# EAGLE design pCog105_LogicStart (EAGLE 6.6.0)

## Sheet 1 of 4
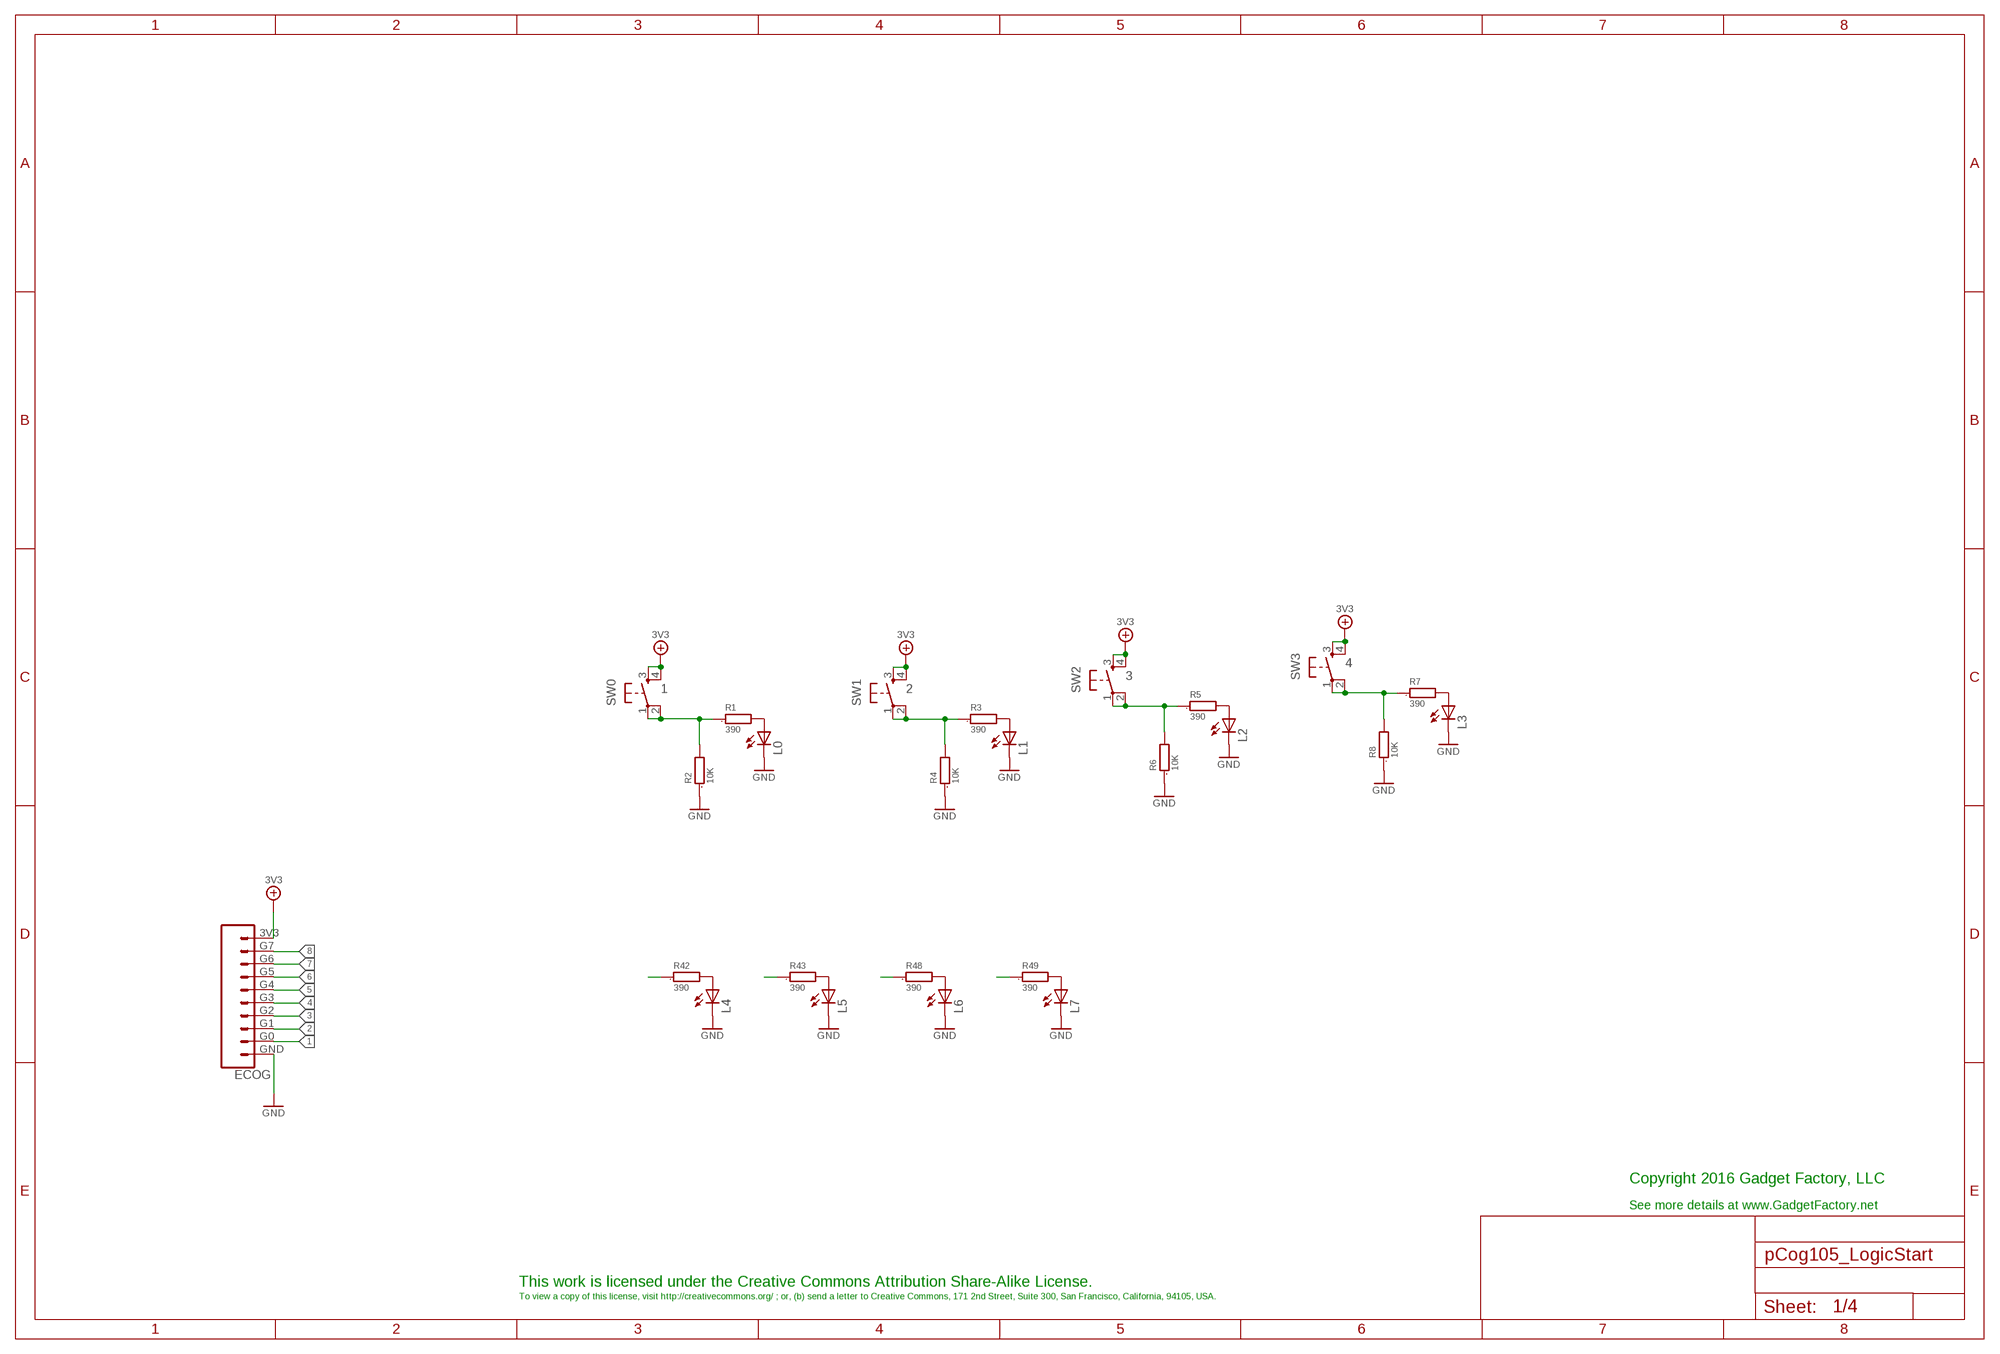
[diagram p0: schematic, sheet 1]

### Parts
ECOG  ECOG_GENERAL_ROWTHROUGHOLE  [ECOG_GENERAL_TH]
L0  LEDCHIP-LED0805  [CHIP-LED0805]
L1  LEDCHIP-LED0805  [CHIP-LED0805]
L2  LEDCHIP-LED0805  [CHIP-LED0805]
L3  LEDCHIP-LED0805  [CHIP-LED0805]
L4  LEDCHIP-LED0805  [CHIP-LED0805]
L5  LEDCHIP-LED0805  [CHIP-LED0805]
L6  LEDCHIP-LED0805  [CHIP-LED0805]
L7  LEDCHIP-LED0805  [CHIP-LED0805]
R1  390  R0805  [0805]
R2  10K  R0805  [0805]
R3  390  R0805  [0805]
R4  10K  R0805  [0805]
R5  390  R0805  [0805]
R6  10K  R0805  [0805]
R7  390  R0805  [0805]
R8  10K  R0805  [0805]
R42  390  R0805  [0805]
R43  390  R0805  [0805]
R48  390  R0805  [0805]
R49  390  R0805  [0805]
SW0  TAC_SWITCHPTH  [TACTILE-PTH]
SW1  TAC_SWITCHPTH  [TACTILE-PTH]
SW2  TAC_SWITCHPTH  [TACTILE-PTH]
SW3  TAC_SWITCHPTH  [TACTILE-PTH]

### Nets
1: ECOG.G0 R1.1 R2.2 SW0.1 SW0.2
2: ECOG.G1 R3.1 R4.2 SW1.1 SW1.2
3: ECOG.G2 R5.1 R6.2 SW2.1 SW2.2
3V3: ECOG.3V3 SW0.3 SW0.4 SW1.3 SW1.4 SW2.3 SW2.4 SW3.3 SW3.4 ; also sheet 2,3,4
4: ECOG.G3 R7.1 R8.2 SW3.1 SW3.2
5: ECOG.G4 R42.1
6: ECOG.G5 R43.1
7: ECOG.G6 R48.1
8: ECOG.G7 R49.1
GND: ECOG.GND L0.C L1.C L2.C L3.C L4.C L5.C L6.C L7.C R2.1 R4.1 R6.1 R8.1 ; also sheet 2,3,4
N$1: L0.A R1.2
N$2: L1.A R3.2
N$3: L2.A R5.2
N$4: L3.A R7.2
N$13: L4.A R42.2
N$14: L5.A R43.2
N$15: L6.A R48.2
N$16: L7.A R49.2

### Notes on the sheet
- Copyright 2016 Gadget Factory, LLC
- See more details at www.GadgetFactory.net
- This work is licensed under the Creative Commons Attribution Share-Alike License.
- To view a copy of this license, visit http://creativecommons.org/ ; or, (b) send a letter to Creative Commons, 171 2nd Street, Suite 300, San Francisco, California, 94105, USA.

## Sheet 2 of 4
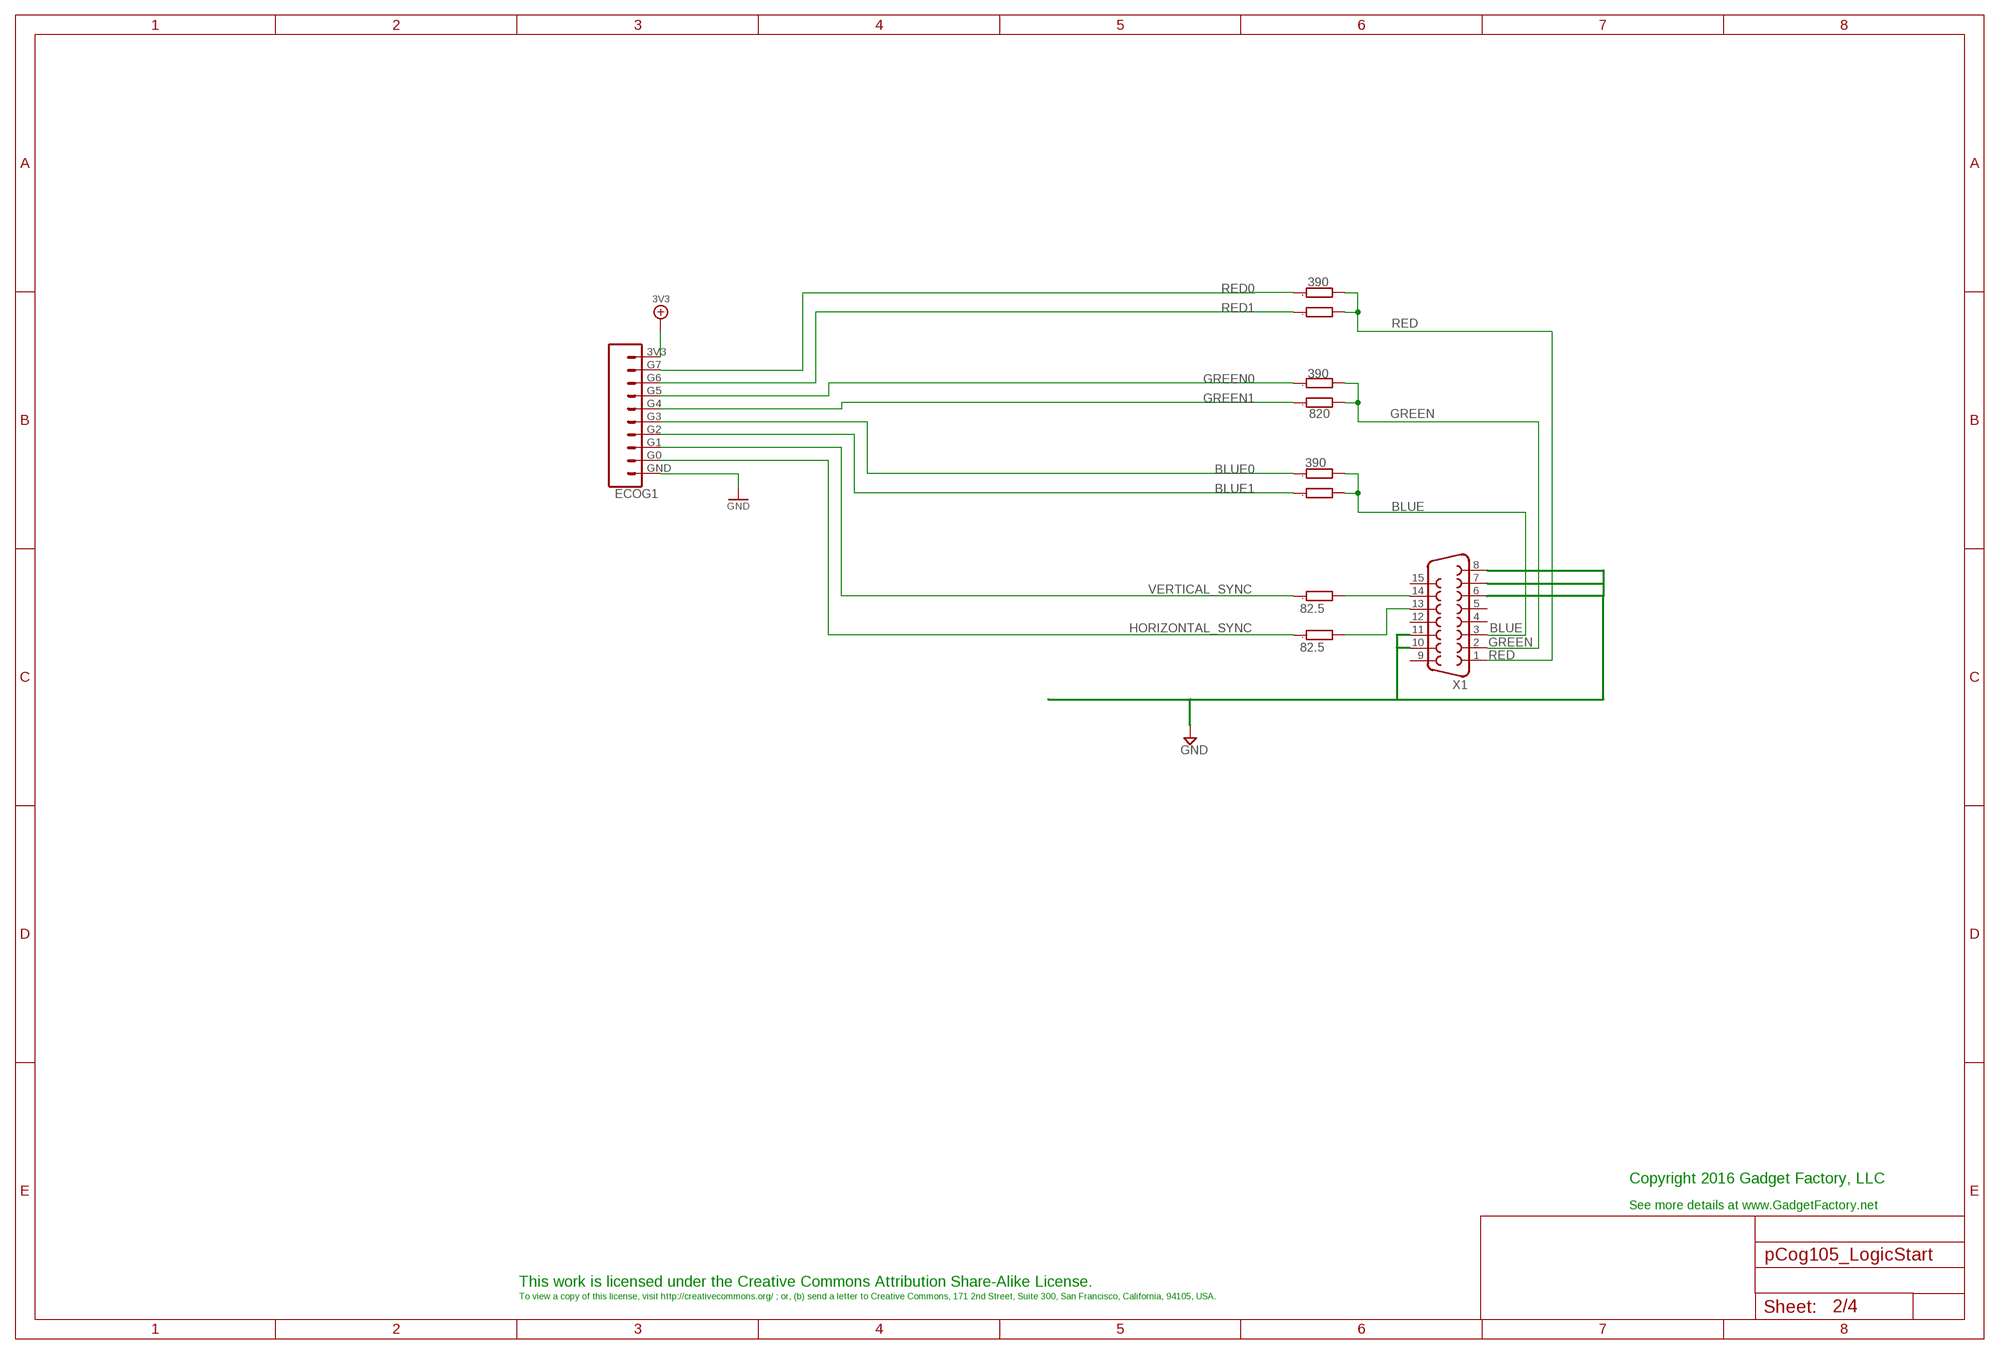
[diagram p1: schematic, sheet 2]

### Parts
ECOG1  ECOG_GENERAL_ROWTHROUGHOLE  [ECOG_GENERAL_TH]
R34  390  R0603  [0603]
R35  820  R0603  [0603]
R40  820  R0603  [0603]
R41  390  R0603  [0603]
R44  820  R0603  [0603]
R45  390  R0603  [0603]
R46  82.5  R0603  [0603]
R47  82.5  R0603  [0603]
X1  F15HDH  [HDF15H]

### Nets
3V3: ECOG1.3V3 ; also sheet 1,3,4
BLUE: R44.2 R45.2 X1.3
BLUE0: ECOG1.G3 R45.1
BLUE1: ECOG1.G2 R44.1
GND: ECOG1.GND X1.6 X1.7 X1.8 X1.10 X1.11 ; also sheet 1,3,4
GREEN: R40.2 R41.2 X1.2
GREEN0: ECOG1.G5 R41.1
GREEN1: ECOG1.G4 R40.1
HORIZONTAL_SYNC: ECOG1.G0 R47.1
N$5: R47.2 X1.13
N$6: R46.2 X1.14
RED: R34.2 R35.2 X1.1
RED0: ECOG1.G7 R34.1
RED1: ECOG1.G6 R35.1
VERTICAL_SYNC: ECOG1.G1 R46.1
Unconnected: X1.4 X1.5 X1.9 X1.12 X1.15

### Notes on the sheet
- Copyright 2016 Gadget Factory, LLC
- See more details at www.GadgetFactory.net
- This work is licensed under the Creative Commons Attribution Share-Alike License.
- To view a copy of this license, visit http://creativecommons.org/ ; or, (b) send a letter to Creative Commons, 171 2nd Street, Suite 300, San Francisco, California, 94105, USA.

## Sheet 3 of 4
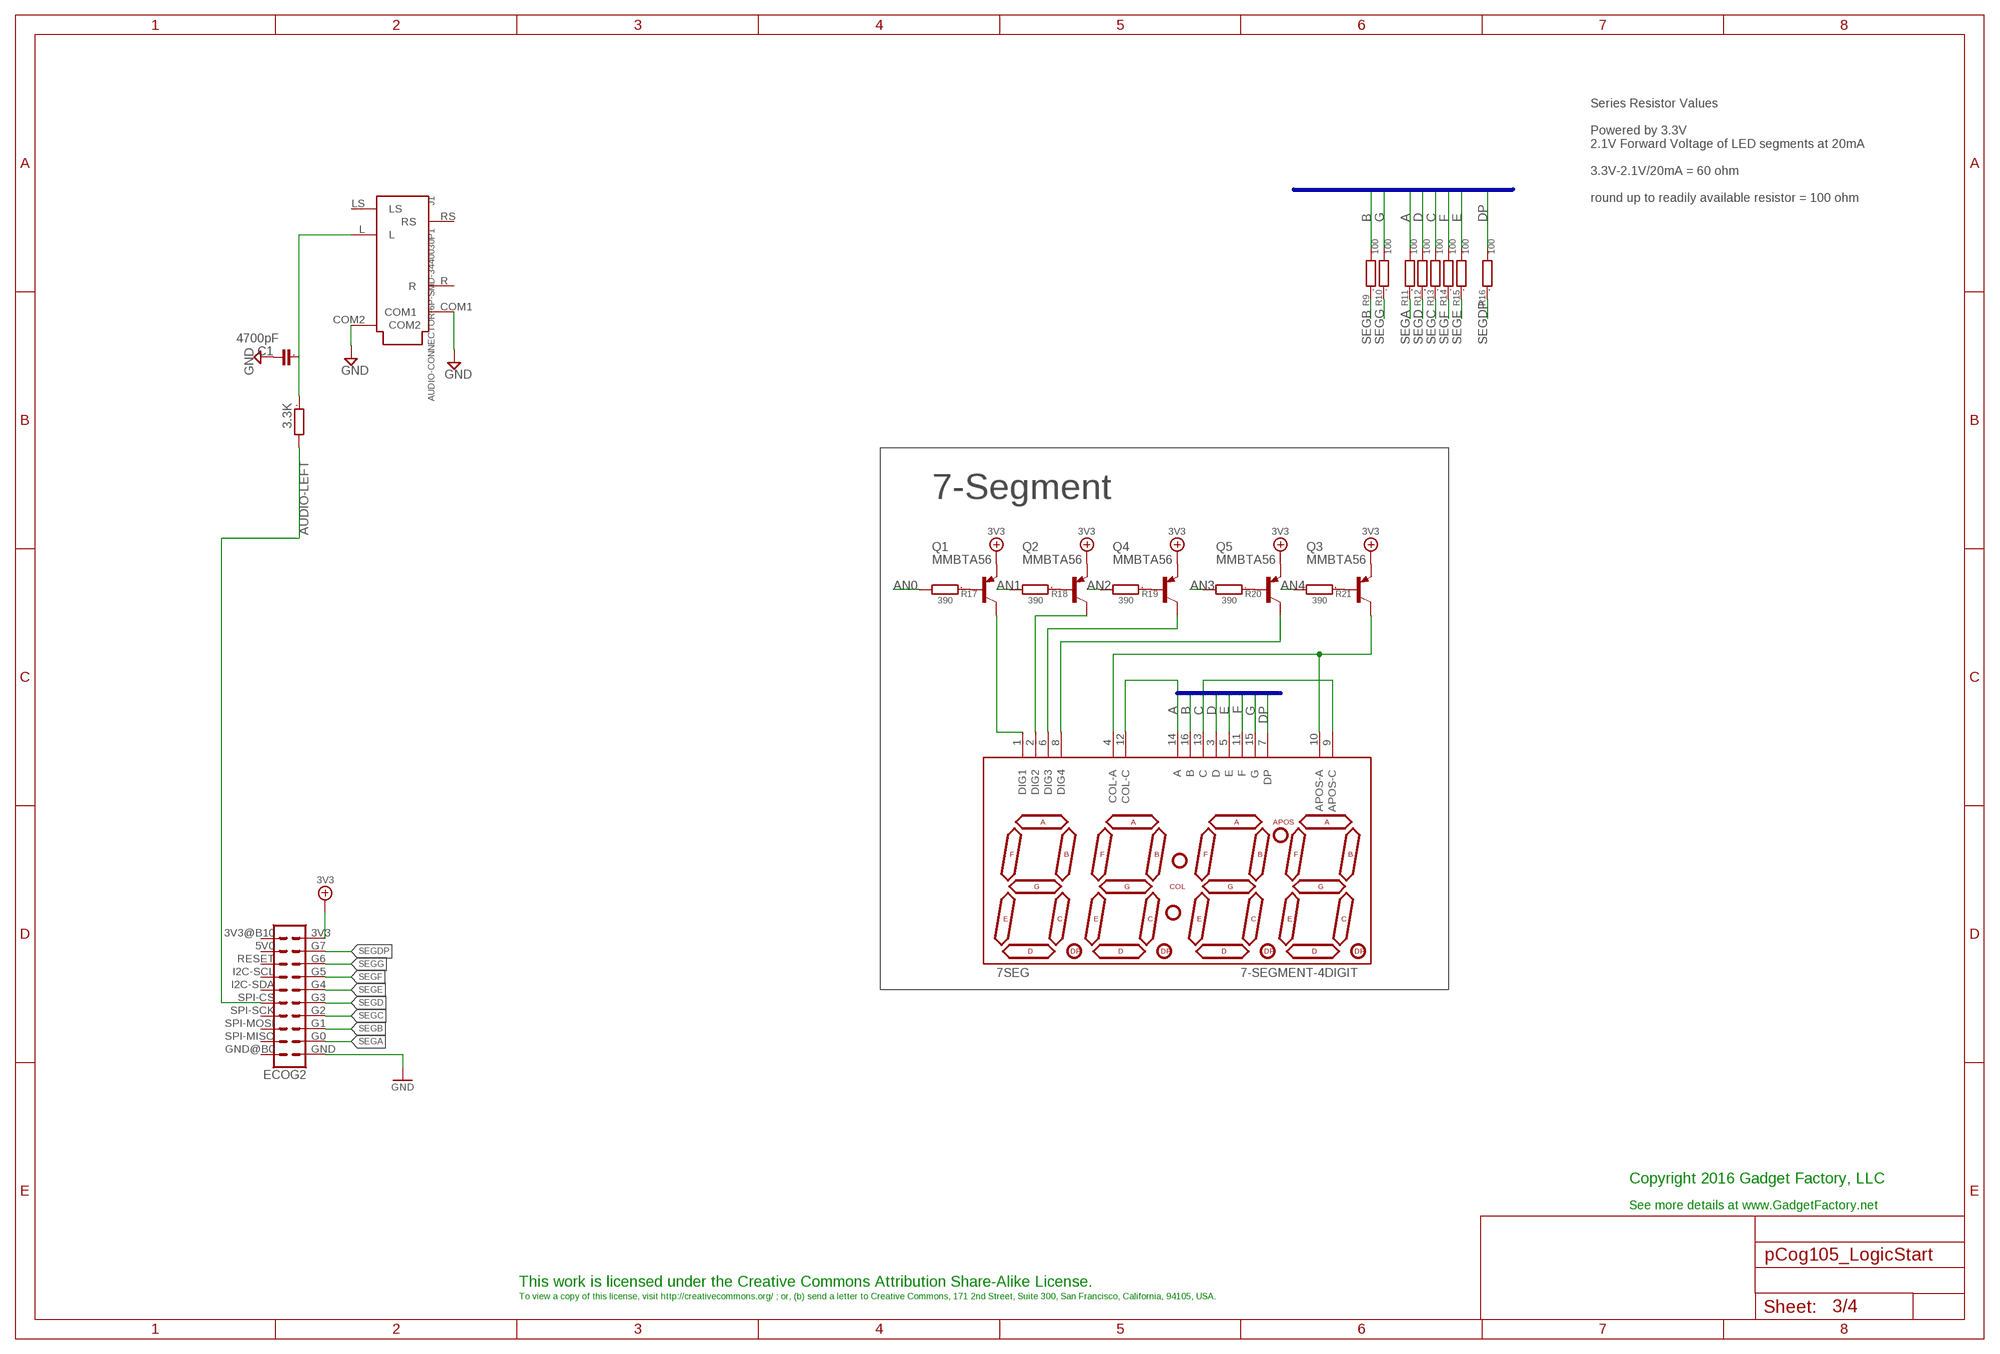
[diagram p2: schematic, sheet 3]

### Parts
7SEG  7-SEGMENT-4DIGIT  [7-SEGMENT-4DIGIT]
C1  4700pF  C0603  [0603]
ECOG2  ECOG_DUALTHROUGHHOLE  [ECOG_DUAL_TH]
J1  AUDIO-CONNECTOR-6P-SMD-3440030P1  [6P-SMD-3.5]
Q1  MMBTA56  MMBTA56-SOT23  [SOT23]
Q2  MMBTA56  MMBTA56-SOT23  [SOT23]
Q3  MMBTA56  MMBTA56-SOT23  [SOT23]
Q4  MMBTA56  MMBTA56-SOT23  [SOT23]
Q5  MMBTA56  MMBTA56-SOT23  [SOT23]
R9  100  R0603  [0603]
R10  100  R0603  [0603]
R11  100  R0603  [0603]
R12  100  R0603  [0603]
R13  100  R0603  [0603]
R14  100  R0603  [0603]
R15  100  R0603  [0603]
R16  100  R0603  [0603]
R17  390  R0603  [0603]
R18  390  R0603  [0603]
R19  390  R0603  [0603]
R20  390  R0603  [0603]
R21  390  R0603  [0603]
R39  3.3K  R0603  [0603]

### Nets
3V3: ECOG2.3V3 Q1.2(E) Q2.2(E) Q3.2(E) Q4.2(E) Q5.2(E) ; also sheet 1,2,4
A: 7SEG.12(COL-C) 7SEG.14(A) R11.2
AN0: R17.2
AN1: R18.2
AN2: R19.2
AN3: R20.2
AN4: R21.2
APOS_A: 7SEG.4(COL-A) 7SEG.10(APOS-A) Q3.3(C)
AUDIO-LEFT: ECOG2.SPI-CS R39.2
B: 7SEG.16(B) R9.2
C: 7SEG.9(APOS-C) 7SEG.13(C) R13.2
D: 7SEG.3(D) R12.2
DP: 7SEG.7(DP) R16.2
E: 7SEG.5(E) R15.2
F: 7SEG.11(F) R14.2
G: 7SEG.15(G) R10.2
GND: C1.2 ECOG2.GND J1.COM1 J1.COM2 ; also sheet 1,2,4
N$7: Q1.1(B) R17.1
N$8: Q2.1(B) R18.1
N$9: Q4.1(B) R19.1
N$10: Q5.1(B) R20.1
N$11: Q3.1(B) R21.1
N$12: C1.1 J1.L R39.1
N$29: 7SEG.1(DIG1) Q1.3(C)
N$30: 7SEG.2(DIG2) Q2.3(C)
N$31: 7SEG.6(DIG3) Q4.3(C)
N$32: 7SEG.8(DIG4) Q5.3(C)
SEGA: ECOG2.G0 R11.1
SEGB: ECOG2.G1 R9.1
SEGC: ECOG2.G2 R13.1
SEGD: ECOG2.G3 R12.1
SEGDP: ECOG2.G7 R16.1
SEGE: ECOG2.G4 R15.1
SEGF: ECOG2.G5 R14.1
SEGG: ECOG2.G6 R10.1
Unconnected: ECOG2.3V3@B10(3V3) ECOG2.5V0(5V) ECOG2.GND@B0(GND) ECOG2.I2C-SCL ECOG2.I2C-SDA ECOG2.RESET ECOG2.SPI-MISO ECOG2.SPI-MOSI ECOG2.SPI-SCK J1.LS J1.R J1.RS

### Buses
A,B,C,D,E,F,G,DP,COL_A,COL_C,APOS_A,APOS_C
RED[0..2],GREEN[0..2],BLUE[0..1],VERTICAL_SYNC,HORIZONTAL_SYNC,AUDIO,SPI_SCLK,SPI_DIN,SPI_DOUT,SPI_CS,JOY_SELECT,JOY_RIGHT,JOY_LEFT,JOY_DOWN,JOY_UP,AN[0..3],A,B,C,D,E,F,G,DP

### Notes on the sheet
- Series Resistor Values
  
  Powered by 3.3V
  2.1V Forward Voltage of LED segments at 20mA
  
  3.3V-2.1V/20mA = 60 ohm
  
  round up to readily available resistor = 100 ohm
- 7-Segment
- Copyright 2016 Gadget Factory, LLC
- See more details at www.GadgetFactory.net
- This work is licensed under the Creative Commons Attribution Share-Alike License.
- To view a copy of this license, visit http://creativecommons.org/ ; or, (b) send a letter to Creative Commons, 171 2nd Street, Suite 300, San Francisco, California, 94105, USA.

## Sheet 4 of 4
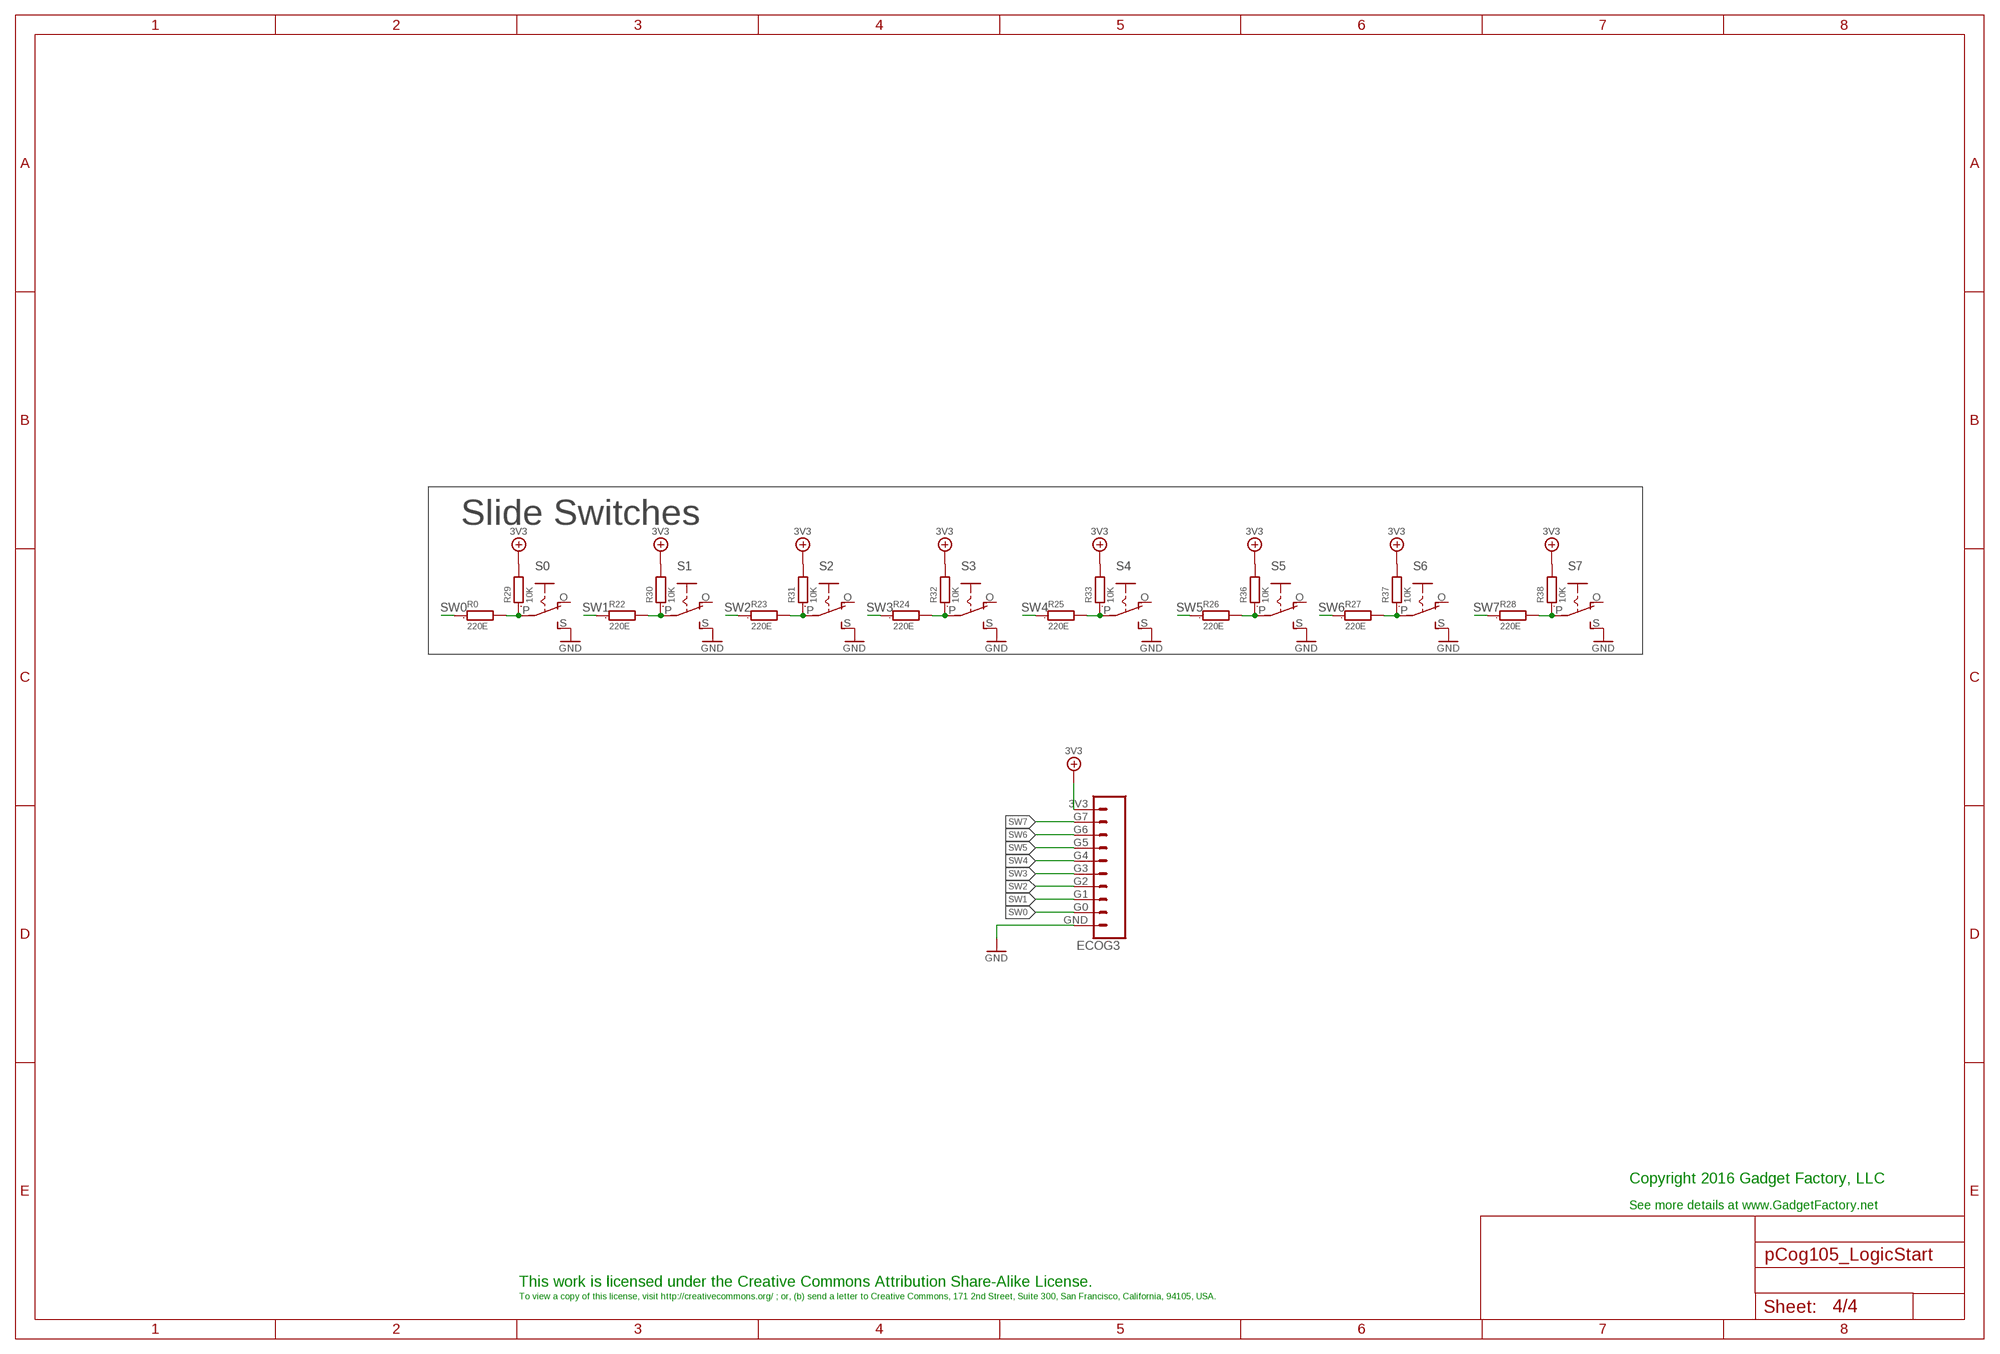
[diagram p3: schematic, sheet 4]

### Parts
ECOG3  ECOG_GENERAL_ROWTHROUGHOLE  [ECOG_GENERAL_TH]
R0  220E  R0603  [0603]
R22  220E  R0603  [0603]
R23  220E  R0603  [0603]
R24  220E  R0603  [0603]
R25  220E  R0603  [0603]
R26  220E  R0603  [0603]
R27  220E  R0603  [0603]
R28  220E  R0603  [0603]
R29  10K  R0603  [0603]
R30  10K  R0603  [0603]
R31  10K  R0603  [0603]
R32  10K  R0603  [0603]
R33  10K  R0603  [0603]
R36  10K  R0603  [0603]
R37  10K  R0603  [0603]
R38  10K  R0603  [0603]
S0  EG1218S  [EG1218]
S1  EG1218S  [EG1218]
S2  EG1218S  [EG1218]
S3  EG1218S  [EG1218]
S4  EG1218S  [EG1218]
S5  EG1218S  [EG1218]
S6  EG1218S  [EG1218]
S7  EG1218S  [EG1218]

### Nets
3V3: ECOG3.3V3 R29.2 R30.2 R31.2 R32.2 R33.2 R36.2 R37.2 R38.2 ; also sheet 1,2,3
GND: ECOG3.GND S0.S S1.S S2.S S3.S S4.S S5.S S6.S S7.S ; also sheet 1,2,3
S5: R26.2 R36.1 S5.P
SW0: ECOG3.G0 R0.1
SW0_JOY_UP_IN: R0.2 R29.1 S0.P
SW1: ECOG3.G1 R22.1
SW1__JOY_DOWN_IN: R22.2 R30.1 S1.P
SW2: ECOG3.G2 R23.1
SW2_JOY_SELECT_IN: R23.2 R31.1 S2.P
SW3: ECOG3.G3 R24.1
SW3_JOY_RIGHT_IN: R24.2 R32.1 S3.P
SW4: ECOG3.G4 R25.1
SW4_JOY_LEFT_IN: R25.2 R33.1 S4.P
SW5: ECOG3.G5 R26.1
SW6: ECOG3.G6 R27.1
SW6_IN: R27.2 R37.1 S6.P
SW7: ECOG3.G7 R28.1
SW7_IN: R28.2 R38.1 S7.P
Unconnected: S0.O S1.O S2.O S3.O S4.O S5.O S6.O S7.O

### Notes on the sheet
- Slide Switches
- Copyright 2016 Gadget Factory, LLC
- See more details at www.GadgetFactory.net
- This work is licensed under the Creative Commons Attribution Share-Alike License.
- To view a copy of this license, visit http://creativecommons.org/ ; or, (b) send a letter to Creative Commons, 171 2nd Street, Suite 300, San Francisco, California, 94105, USA.

## Library data of the parts
7SEG = GadgetFactory_Pub_1_0:7-SEGMENT-4DIGIT: This is a part for the 4-Digit 7-segment LEDs from Young Sun. Different from the Digikey LEDs, all 16 pins are used. The LONGPADS Variant is used for a test jig, but you may like it because there is more pad to solder to. If you are concerned about routing space, the standard works just fine though.; PARTNO: AL-D4012BWSR/58-040C
C1 = GadgetFactory:C: CAPACITOR, European symbol; PARTNO: C0603C472J5RACTU
ECOG ECOG1 ECOG3 = eCogs:ECOG_GENERAL_ROW
ECOG2 = eCogs:ECOG_DUAL
J1 = OPL Eagle Library:AUDIO-CONNECTOR-6P-SMD: When you use the footprint ,place notice 46 (layer)milling ,there is some important information.; PARTNO: 3440030P1
L0 L1-L7 = adafruit:LED: LED OSRAM: - CHIPLED LG R971, LG N971, LY N971, LG Q971, LY Q971, LO R971, LY R971 LH N974, LH R974 LS Q976, LO Q976, LY Q976 LO Q996 - Hyper CHIPLED LW Q18S LB Q993, LB Q99A, LB R99A - SideLED LS A670, LO A670, LY A670, LG A670, LP A670 LB A673, LV A673, LT A673, LW A673 LH A674 LY A675 LS A676, LA A676, LO A676, LY A676, LW A676 LS A679, LY A679, LG A679 - Hyper Micro SIDELED® LS Y876, LA Y876, LO Y876, LY Y876 LT Y87S - SmartLED LW L88C, LW L88S LB L89C, LB L89S, LG L890 LS L89K, LO L89K, LY L89K LS L896, LA L896, LO L896, LY L896 - TOPLED LS T670, LO T670, LY T670, LG T670, LP T670 LSG T670, LSP T670, LSY T670, LOP T670, LYG T670 LG T671, LOG T671, LSG T671 LB T673, LV T673, LT T673, LW T673 LH T674 LS T676, LA T676, LO T676, LY T676, LB T676, LH T676, LSB T676, LW T676 LB T67C, LV T67C, LT T67C, LS T67K, LO T67K, LY T67K, LW E67C LS E67B, LA E67B, LO E67B, LY E67B, LB E67C, LV E67C, LT E67C LW T67C LS T679, LY T679, LG T679 LS T770, LO T770, LY T770, LG T770, LP T770 LB T773, LV T773, LT T773, LW T773 LH T774 LS E675, LA E675, LY E675, LS T675 LS T776, LA T776, LO T776, LY T776, LB T776 LHGB T686 LT T68C, LB T68C - Hyper Mini TOPLED® LB M676 - Mini TOPLED Santana® LG M470 LS M47K, LO M47K, LY M47K Source: http://www.osram.convergy.de/; DIGIKEY: 475-1410-2-ND
Q1-Q5 = transistor-pnp:*-?: PNP Transistor; PARTNO: MMBTA56
R0 R22-R28 = GadgetFactory:R: RESISTOR, European symbol; PARTNO: RMCF0603JT220R
R1 R3 R5 R7 R42 R43 R48 R49 = GadgetFactory:R: RESISTOR, European symbol; DIGIKEY: RMCF0805JT390RCT-ND
R2 R4 R6 R8 = GadgetFactory:R: RESISTOR, European symbol; DIGIKEY: RMCF0805JT10K0CT-ND
R9-R21 = GadgetFactory:R: RESISTOR, European symbol; PARTNO: CRCW0603100RJNEA
R29-R33 R36-R38 = GadgetFactory:R: RESISTOR, European symbol; PARTNO: RMCF0603JT10K0
R34 R41 R45 = GadgetFactory:R: RESISTOR, European symbol; PARTNO: RMCF0603JT3K90
R35 R40 R44 = GadgetFactory:R: RESISTOR, European symbol; PARTNO: RMCF0603JT2K00
R39 = GadgetFactory:R: RESISTOR, European symbol; PARTNO: RMCF0603JT3K30
R46 R47 = GadgetFactory:R: RESISTOR, European symbol; PARTNO: RMCF0603FT82R5
S0 S1-S7 = GadgetFactory_Pub_1_0:EG1218: SLIDING SWITCH 0.1" spacing through hole, vertical SPDT slide switch http://www.ladyada.net/library/pcb/eaglelibrary.html; PARTNO: EG1218
SW0 SW1-SW3 = SparkFun:TAC_SWITCH: Momentary Switch Button commonly used for reset or general input. Spark Fun Electronics SKU : COM-00097; DIGIKEY: 679-2428-ND
X1 = GadgetFactory_6.0:F15: SUB-D; OC_FARNELL: unknown; OC_NEWARK: unknown; PARTNO: 1-1734530-1

## Board
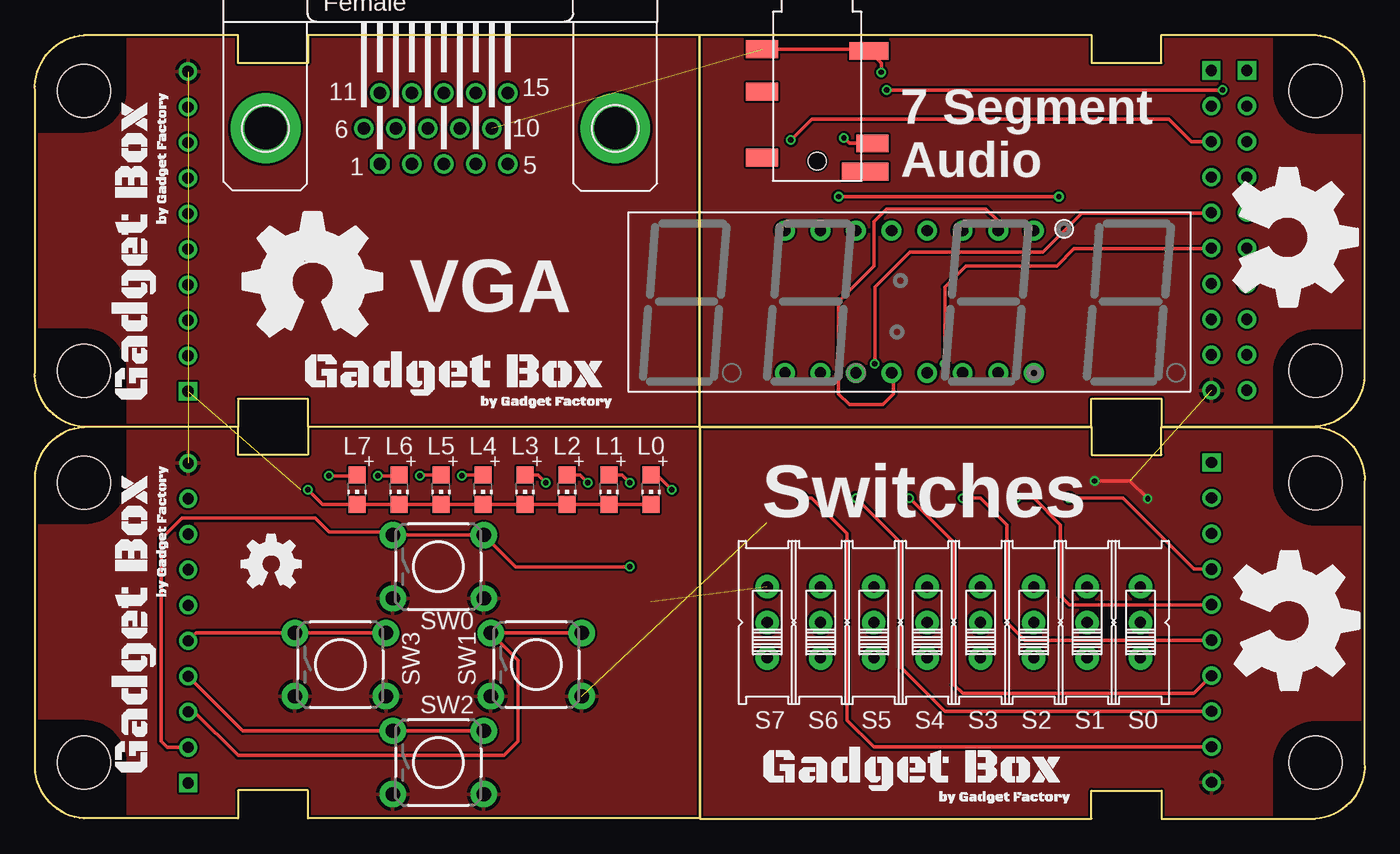
[diagram p4: board, top side]
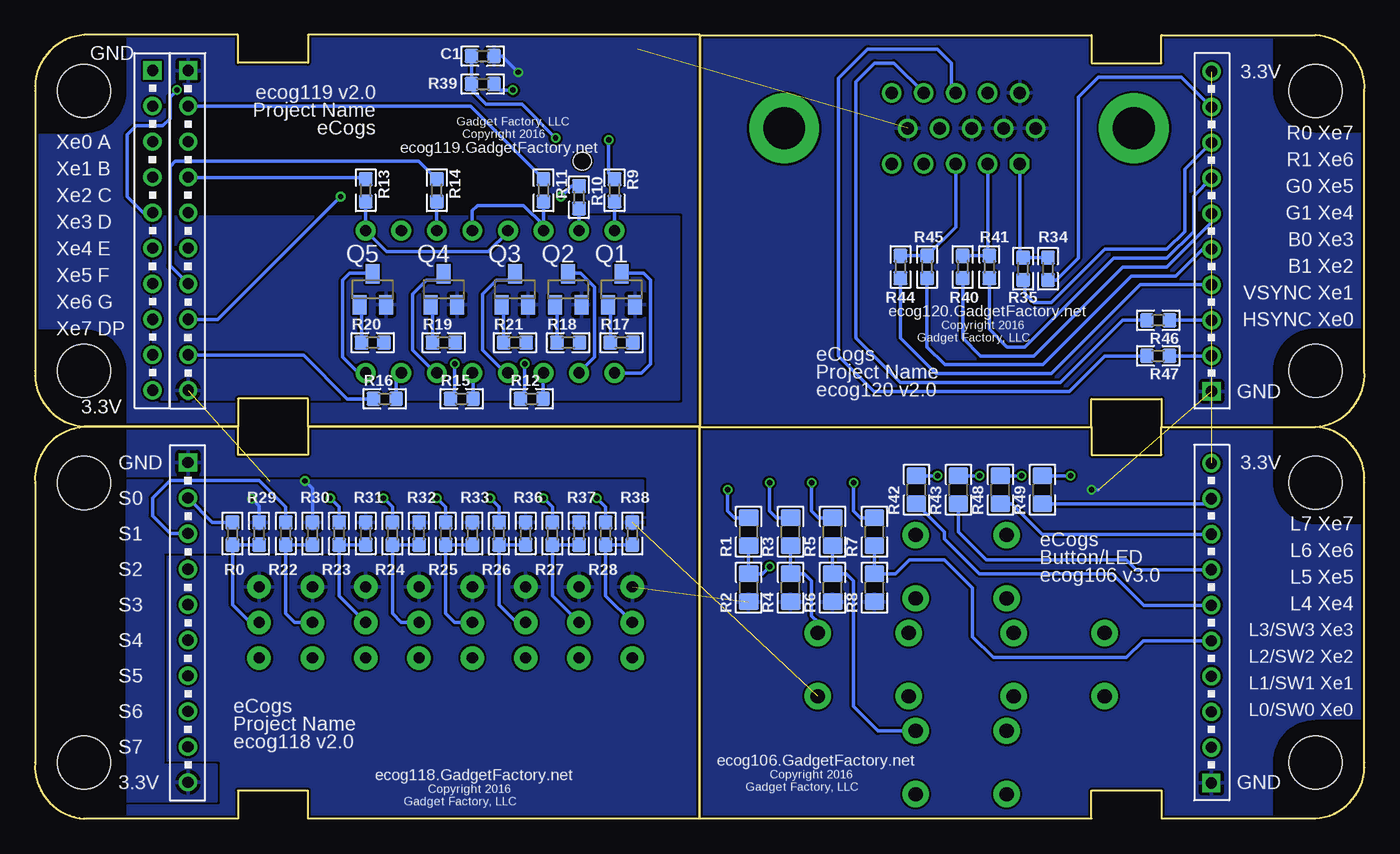
[diagram p5: board, bottom side, seen from below]

Size 95.02 x 56.02 mm. Coordinates in mm from the lower left corner, seen from the top.
Copper layers (1*16): Top 0.035mm / dielectric 1.5mm / Bottom 0.035mm
Design rules "hackvana *": minimum track width 6mil, minimum drill 0.3mm, track to track 6mil, track to pad 6mil, pad to pad 6mil, via to via 6mil, smd to smd 0mil, copper to edge 6mil, drill to drill 6mil, minimum pad ring 10mil, minimum via ring 6mil, stop-mask expansion 2mil, vias tented up to drill 100mil, thermal gap 10mil

### Footprints (pad centres in the part's own frame; a part is rotated, then mirrored left to right if it is on the bottom)
7-SEGMENT-4DIGIT = drill 0.8 pad 1.422: 1 -8.89,-5.08; 2 -6.35,-5.08; 3 -3.81,-5.08; 4 -1.27,-5.08; 5 1.27,-5.08; 6 3.81,-5.08; 7 6.35,-5.08; 8 8.89,-5.08; 9 8.89,5.08; 10 6.35,5.08; 11 3.81,5.08; 12 1.27,5.08; 13 -1.27,5.08; 14 -3.81,5.08; 15 -6.35,5.08; 16 -8.89,5.08
0603 = smd 1 x 1: 1 -0.8,0; 2 0.8,0
ECOG_GENERAL_TH = drill 0.8: 3V3 11.43,25.4; G0 11.43,5.08; G1 11.43,7.62; G2 11.43,10.16; G3 11.43,12.7; G4 11.43,15.24; G5 11.43,17.78; G6 11.43,20.32; G7 11.43,22.86 | drill 0.8 square: GND 11.43,2.54 | hole 3.8: 4,24; 4,4
ECOG_DUAL_TH = drill 0.8: 3V3 11.43,25.4; 3V3@B10 8.89,25.4; 5V0 8.89,22.86; G0 11.43,5.08; G1 11.43,7.62; G2 11.43,10.16; G3 11.43,12.7; G4 11.43,15.24; G5 11.43,17.78; G6 11.43,20.32; G7 11.43,22.86; I2C-SCL 8.89,17.78; I2C-SDA 8.89,15.24; RESET 8.89,20.32; SPI-CS 8.89,12.7; SPI-MISO 8.89,5.08; SPI-MOSI 8.89,7.62; SPI-SCK 8.89,10.16 | drill 0.8 square: GND 11.43,2.54; GND@B0 8.89,2.54 | hole 3.8: 4,24; 4,4
6P-SMD-3.5 = smd 1.27 x 2.286: COM1 2.413,3.937; L -4.318,-3.937; R -0.635,3.937; RS -5.334,3.937 | smd 1.27 x 2.794: COM2 2.286,-3.683 | smd 1.27 x 3.302: LS -6.35,-3.429 | hole 1.27: -5.588,0
CHIP-LED0805 = smd 1.2 x 1.2: A 0,-1.05; C 0,1.05
SOT23 = smd 1 x 1.4: 1 -0.95,-1.1; 2 0.95,-1.1; 3 0,1.1
0805 = smd 1.2 x 1.4: 1 -1,0; 2 1,0
EG1218 = drill 0.8 pad 1.676: O -2.54,0; P 0,0; S 2.54,0
TACTILE-PTH = drill 1.016 pad 1.88: 1 -3.251,2.261; 2 3.251,2.261; 3 -3.251,-2.261; 4 3.251,-2.261
HDF15H = drill 0.9 octagon: 1 4.329,2.54 | drill 0.9: 2 2.043,2.54; 3 -0.243,2.54; 4 -2.529,2.54; 5 -4.815,2.54; 6 5.472,0; 7 3.186,0; 8 0.9,0; 9 -1.386,0; 10 -3.672,0; 11 4.329,-2.54; 12 2.043,-2.54; 13 -0.243,-2.54; 14 -2.529,-2.54; 15 -4.815,-2.54 | drill 3 pad 5: P$1 -12.5,0; P$2 12.5,0

### Placement (x,y rotation side)
7SEG  62.49,36.95 0 top
C1  63.01,54.51 0 bottom
ECOG  -0.49,0.01 0 top
ECOG1  -0.49,28.01 0 top
ECOG2  95.5,56.02 180 top
ECOG3  95.51,28 180 top
J1  55.9,52.59 90 top
L0  44.01,23.51 180 top
L1  41.01,23.51 180 top
L2  38.01,23.51 180 top
L3  35.01,23.51 180 top
L4  32.01,23.51 180 top
L5  29.01,23.51 180 top
L6  26.01,23.51 180 top
L7  23.01,23.51 180 top
Q1  53.1,37.84 0 bottom
Q2  56.91,37.84 0 bottom
Q3  60.72,37.84 0 bottom
Q4  65.8,37.84 0 bottom
Q5  70.88,37.84 0 bottom
R0  80.9,20.38 270 bottom
R1  44.01,20.51 90 bottom
R2  44.01,16.51 90 bottom
R3  41.01,20.51 90 bottom
R4  41.01,16.51 90 bottom
R5  38.01,20.51 90 bottom
R6  38.01,16.51 90 bottom
R7  35.01,20.51 90 bottom
R8  35.01,16.51 90 bottom
R9  53.6,44.92 270 bottom
R10  56.14,44.42 270 bottom
R11  58.68,44.92 270 bottom
R12  59.51,30.01 0 bottom
R13  71.38,44.92 270 bottom
R14  66.3,44.92 270 bottom
R15  64.51,30.01 0 bottom
R16  70.01,30.01 0 bottom
R17  53.1,34.03 0 bottom
R18  56.91,34.03 0 bottom
R19  65.8,34.03 0 bottom
R20  70.88,34.03 0 bottom
R21  60.72,34.03 0 bottom
R22  77.09,20.38 270 bottom
R23  73.28,20.38 270 bottom
R24  69.47,20.38 270 bottom
R25  65.66,20.38 270 bottom
R26  61.85,20.38 270 bottom
R27  58.04,20.38 270 bottom
R28  54.23,20.38 270 bottom
R29  79,20.38 90 bottom
R30  75.19,20.38 90 bottom
R31  71.38,20.38 90 bottom
R32  67.57,20.38 90 bottom
R33  63.76,20.38 90 bottom
R34  22.62,39.31 90 bottom
R35  24.4,39.31 90 bottom
R36  59.95,20.38 90 bottom
R37  56.14,20.38 90 bottom
R38  52.33,20.38 90 bottom
R39  63.01,52.51 0 bottom
R40  28.72,39.44 90 bottom
R41  26.81,39.44 90 bottom
R42  32.01,23.51 90 bottom
R43  29.01,23.51 90 bottom
R44  33.16,39.44 90 bottom
R45  31.26,39.44 90 bottom
R46  14.75,35.63 180 bottom
R47  14.75,33.09 180 bottom
R48  26.01,23.51 90 bottom
R49  23.01,23.51 90 bottom
S0  79,14.03 90 top
S1  75.19,14.03 90 top
S2  71.38,14.03 90 top
S3  67.57,14.03 90 top
S4  63.76,14.03 90 top
S5  59.95,14.03 90 top
S6  56.14,14.03 90 top
S7  52.33,14.03 90 top
SW0  28.82,18.01 0 top
SW1  35.82,11.01 0 top
SW2  28.82,4.01 0 top
SW3  21.82,11.01 0 top
U$1  [GADGETBOX_SMALL]  7.13,40.65 90 top
U$2  [GADGETBOX_SMALL]  29.99,31.76 0 top
U$5  [GADGETBOX_SMALL]  7.13,13.98 90 top
U$6  [OSHW_FILLX150_NOTEXT]  14.75,16.52 0 top
U$10  [OSHW_FILLX350_NOTEXT]  14.87,34.48 0 top
U$18  [OSHW_FILLX350_NOTEXT]  85.64,46.52 270 top
U$28  [OSHW_FILLX350_NOTEXT]  85.73,19.11 270 top
U$35  [GADGETBOX_SMALL]  62.74,3.49 0 top
X1  28.97,49.34 180 top

### Tracks (layer width: path | path; a pad name or v marks a point on that pad's centre or on a via)
1  (via drill 0.38)
  Top 0.254: ECOG.G0 9.43,5.09 9.01,5.51 9.01,20.01 10.51,21.51 20.01,21.51 21.01,20.51 25.33,20.51 SW0.1 SW0.2 34.34,18.01 v42.51,18.01
  Bottom 0.254: R1.1 R2.2 43.01,17.51 v42.51,18.01
2
  Top 0.254: ECOG.G1 11.39,7.63 14.51,4.51 33.51,4.51 34.51,5.51 34.51,11.33 SW1.1 SW1.2
  Bottom 0.254: R3.1 R4.2 40.01,17.51 39.51,17.01 39.51,14.51 39.08,14.08 SW1.2
3
  Top 0.254: SW2.2 SW2.1 14.84,6.28 ECOG.G2
  Bottom 0.254: R5.1 R6.2 37.01,17.51 36.51,17.01 36.51,8.01 34.78,6.28 SW2.2
3V3  (via drill 0.38)  (3 unrouted)
  Top 0.254: 76.22,24.14 v75.71,24.14 78.25,24.14 v79.52,22.87
  Bottom 0.254: R30.2 75.19,23.62 v75.71,24.14 | R29.2 79,22.35 v79.52,22.87
  pour Top: -0.49,57.01 -0.49,-0.99 96.51,-0.99 96.51,57.01
  pour Bottom: 49.01,30.01 49.01,43.01 86.51,43.01 86.51,30.01
  pour Bottom: 51.58,24.14 88.41,24.14 88.41,1.28 82.06,1.28 82.06,3.82 85.87,3.82 85.87,19.06 51.58,19.06
4
  Top 0.254: ECOG.G3 11.51,13.28 SW3.1 SW3.2
  Bottom 0.254: R7.1 R8.2 33.51,17.51 32.51,18.51 30.01,18.51 28.01,16.51 28.01,13.01 26.51,11.51 17.01,11.51 15.81,12.71 ECOG.G3
5
  Bottom 0.254: ECOG.G4 15.75,15.25 18.01,17.51 27.51,17.51 30.01,20.01 30.01,20.51 R42.1
6
  Bottom 0.254: ECOG.G5 16.29,17.79 17.01,18.51 27.01,18.51 29.01,20.51 R43.1
7
  Bottom 0.254: ECOG.G6 23.03,20.33 25.21,22.51 R48.1
8
  Bottom 0.254: R49.1 11.3,22.51 ECOG.G7
A
  Bottom 0.254: R11.2 7SEG.14 58.68,42.41 60.09,43.83 63.4,43.83 63.78,43.45 63.78,42.05 7SEG.12
APOS_A
  Top 0.254: 7SEG.10 68.84,42.71 67.97,43.58 60.86,43.58 59.97,42.69 59.97,39.51 57.43,36.97 57.43,30.37 58.19,29.61 60.6,29.61 61.36,30.37 61.36,31.72 7SEG.4
  Bottom 0.254: 7SEG.4 61.37,31.87 63.01,33.51 63.01,37.51 62.01,38.51 61.14,38.51 Q3.3
AUDIO-LEFT  (via drill 0.38)
  Top 0.254: v84.86,52.08 v60.86,52.08
  Bottom 0.254: ECOG2.SPI-CS 87.27,43.32 88.41,44.46 88.41,48.91 87.78,49.54 85.87,49.54 85.37,50.05 85.37,51.58 v84.86,52.08 | v60.86,52.08 61.78,52.08 R39.2
B
  Bottom 0.254: R9.2 7SEG.16
BLUE
  Bottom 0.254: X1.3 29.21,42.28 R45.2 R44.2
BLUE0
  Bottom 0.254: ECOG1.G3 11.57,40.71 13.48,38.8 16.65,38.8 23,32.45 29.99,32.45 31.26,33.72 R45.1
BLUE1
  Bottom 0.254: ECOG1.G2 16.02,38.17 22.37,31.82 30.62,31.82 33.16,34.36 R44.1
C
  Bottom 0.254: R13.2 7SEG.9 69.88,40.53 62.63,40.53 61.22,41.94 7SEG.13
D
  Bottom 0.254: R12.2 58.71,31.83 7SEG.3
DP
  Bottom 0.254: R16.2 69.21,31.49 7SEG.7
E
  Bottom 0.254: R15.2 63.71,31.83 7SEG.5
F
  Bottom 0.254: R14.2 7SEG.11
G
  Bottom 0.254: R10.2 7SEG.15
GND  (via drill 0.38)  (3 unrouted)
  Top 0.254: L0.C L1.C L2.C L3.C L4.C L5.C L6.C L7.C 20.56,22.46 v19.51,23.51 | J1.COM1 59.46,55.01 J1.COM2 60.47,53.99 v60.47,53.35
  Bottom 0.254: v19.51,23.51 19.01,23.51 | C1.2 61.63,54.51 v60.47,53.35
  pour Bottom (rank 2): -1.49,58.01 -1.49,-1.99 97.51,-1.99 97.51,58.01
GREEN
  Bottom 0.254: X1.2 26.93,40.35 R41.2 R40.2
GREEN0
  Bottom 0.254: R41.1 26.81,34.99 25.54,33.72 24.27,33.72 17.92,40.07 14.11,40.07 12.21,41.98 12.21,44.52 ECOG1.G5
GREEN1
  Bottom 0.254: ECOG1.G4 10.94,42.61 14.11,39.44 17.29,39.44 23.64,33.09 27.45,33.09 28.72,34.36 R40.1
HORIZONTAL_SYNC
  Bottom 0.254: ECOG1.G0 R47.1
N$1  (via drill 0.38)
  Top 0.254: L0.A 44.46,24.56 v45.51,23.51
  Bottom 0.254: v45.51,23.51 45.51,22.01 45.01,21.51 R1.2
N$2  (via drill 0.38)
  Top 0.254: L1.A 41.96,24.56 v42.51,24.01
  Bottom 0.254: v42.51,24.01 42.51,22.01 42.01,21.51 R3.2
N$3  (via drill 0.38)
  Top 0.254: L2.A 38.96,24.56 v39.51,24.01
  Bottom 0.254: v39.51,24.01 39.51,22.01 39.01,21.51 R5.2
N$4  (via drill 0.38)
  Top 0.254: L3.A 35.96,24.56 v36.51,24.01
  Bottom 0.254: v36.51,24.01 36.51,22.01 36.01,21.51 R7.2
N$5
  Bottom 0.254: R47.2 18.56,33.09 21.1,30.55 35.07,30.55 37.61,33.09 37.61,52.92 35.51,55.01 30.51,55.01 29.51,54.01 29.51,52.18 X1.13
N$6
  Bottom 0.254: R46.2 17.29,35.63 21.73,31.18 33.16,31.18 36.34,34.36 36.34,52.69 35.01,54.01 33.63,54.01 X1.14
N$7
  Bottom 0.254: R17.1 53.9,36.59 Q1.1
N$8
  Bottom 0.254: R18.1 57.71,36.59 Q2.1
N$9
  Bottom 0.254: R19.1 66.6,36.59 Q4.1
N$10
  Bottom 0.254: R20.1 71.68,36.59 Q5.1
N$11
  Bottom 0.254: R21.1 61.52,36.59 Q3.1
N$12  (via drill 0.38)
  Top 0.254: v57.81,48.66 58.19,48.27 J1.L
  Bottom 0.254: C1.1 R39.1 63.81,52.12 62.76,51.07 60.22,51.07 v57.81,48.66
N$13  (via drill 0.38)
  Top 0.254: L4.A 30.56,24.56 v30.51,24.51
  Bottom 0.254: v30.51,24.51 R42.2
N$14  (via drill 0.38)
  Top 0.254: L5.A 27.56,24.56 v27.51,24.51
  Bottom 0.254: v27.51,24.51 R43.2
N$15  (via drill 0.38)
  Top 0.254: v24.51,24.51 25.96,24.51 L6.A
  Bottom 0.254: R48.2 v24.51,24.51
N$16  (via drill 0.38)
  Top 0.254: v21.01,24.51 22.96,24.51 L7.A
  Bottom 0.254: R49.2 v21.01,24.51
N$29
  Bottom 0.254: 7SEG.1 51.66,31.87 51.01,32.51 51.01,38.51 51.51,39.01 53.02,39.01 Q1.3
N$30
  Bottom 0.254: 7SEG.2 56.14,31.89 55.01,33.01 55.01,38.01 56.01,39.01 56.83,39.01 Q2.3
N$31
  Bottom 0.254: 7SEG.6 66.37,31.87 68.01,33.51 68.01,37.51 67.01,38.51 66.22,38.51 Q4.3
N$32
  Bottom 0.254: 7SEG.8 71.87,31.87 73.01,33.01 73.01,38.51 72.51,39.01 70.95,39.01 Q5.3
RED
  Bottom 0.254: X1.1 24.64,40.35 R35.2 R34.2
RED0
  Bottom 0.254: R34.1 22.02,38.51 20.46,40.07 20.46,51.57 19.01,53.01 13.08,53.01 ECOG1.G7
RED1
  Bottom 0.254: R35.1 24.27,38.38 24.27,37.53 23.64,36.9 22.37,36.9 18.56,40.71 14.11,40.71 12.84,41.98 12.84,46.42 ECOG1.G6
S5
  Bottom 0.254: S5.P 60.58,14.03 61.85,15.3 R26.2 R36.1
SEGA
  Bottom 0.254: R11.1 63.88,50.92 84.05,50.92 ECOG2.G0
SEGB  (via drill 0.38)
  Top 0.254: v54.01,48.51 55.51,50.01 81.01,50.01 82.65,48.38 84.05,48.38 ECOG2.G1
  Bottom 0.254: v54.01,48.51 54.01,46.14 R9.1
SEGC
  Bottom 0.254: R13.1 71.5,45.84 84.05,45.84 ECOG2.G2
SEGD  (via drill 0.38)
  Top 0.254: v60.01,32.51 60.01,38.01 62.51,40.51 72.01,40.51 74.8,43.3 84.05,43.3 ECOG2.G3
  Bottom 0.254: v60.01,32.51 60.01,30.31 R12.1
SEGDP
  Bottom 0.254: R16.1 72.69,30.01 75.82,33.14 84.05,33.14 ECOG2.G7
SEGE  (via drill 0.38)
  Top 0.254: v65.01,32.51 65.01,38.01 66.51,39.51 73.01,39.51 74.26,40.76 84.05,40.76 ECOG2.G4
  Bottom 0.254: v65.01,32.51 65.01,30.31 R15.1
SEGF
  Bottom 0.254: R14.1 67.58,47 84.99,47 85.37,46.62 85.37,39.51 85.33,39.51 85.33,39.5 ECOG2.G5
SEGG  (via drill 0.38)
  Top 0.254: v73.17,44.46 v57.43,44.46
  Bottom 0.254: v73.17,44.46 81.96,35.68 84.05,35.68 ECOG2.G6 | R10.1 56.67,45.22 v57.43,44.46
SW0
  Bottom 0.254: R0.1 82.34,21.18 ECOG3.G0
SW0_JOY_UP_IN
  Bottom 0.254: R29.1 R0.2 80.9,15.3 79.63,14.03 S0.P
SW1
  Bottom 0.254: R22.1 77.09,22.29 79,24.19 85.35,24.19 86.62,22.92 86.62,21.65 85.35,20.38 ECOG3.G1
SW1__JOY_DOWN_IN
  Bottom 0.254: S1.P 76.46,14.03 77.09,14.67 R22.2 R30.1
SW2  (via drill 0.38)
  Top 0.254: v73.92,22.92 77.73,22.92 82.81,17.84 ECOG3.G2
  Bottom 0.254: R23.1 73.28,22.29 v73.92,22.92
SW2_JOY_SELECT_IN
  Bottom 0.254: 71.54,19.58 R31.1 R23.2 73.28,15.94 S2.P
SW3  (via drill 0.38)
  Top 0.254: v70.11,22.92 71.38,22.92 73.28,21.02 73.28,15.94 73.92,15.3 ECOG3.G3
  Bottom 0.254: R24.1 69.47,22.29 v70.11,22.92
SW3_JOY_RIGHT_IN
  Bottom 0.254: R32.1 R24.2 69.47,14.67 68.84,14.03 S3.P
SW4  (via drill 0.38)
  Top 0.254: v66.3,22.92 67.57,22.92 69.47,21.02 69.47,14.03 70.74,12.76 ECOG3.G4
  Bottom 0.254: R25.1 65.66,22.29 v66.3,22.92
SW4_JOY_LEFT_IN
  Bottom 0.254: S4.P 65.03,14.03 65.66,14.67 R25.2 R33.1
SW5  (via drill 0.38)
  Top 0.254: v62.49,22.92 65.66,19.75 65.66,9.59 66.3,8.95 82.81,8.95 ECOG3.G5
  Bottom 0.254: R26.1 61.85,22.29 v62.49,22.92
SW6  (via drill 0.38)
  Top 0.254: v58.68,22.92 61.85,19.75 61.85,10.86 65.03,7.68 ECOG3.G6
  Bottom 0.254: R27.1 58.04,22.29 v58.68,22.92
SW6_IN
  Bottom 0.254: S6.P 58.04,15.94 R27.2 R37.1
SW7  (via drill 0.38)
  Top 0.254: v54.87,22.92 55.5,22.92 58.04,20.38 58.04,7.05 59.95,5.14 ECOG3.G7
  Bottom 0.254: R28.1 54.23,22.29 v54.87,22.92
SW7_IN
  Bottom 0.254: R38.1 R28.2 54.23,15.94 S7.P
VERTICAL_SYNC
  Bottom 0.254: ECOG1.G1 R46.1

### Text on the board
tPlace: 7 Segment / Audio | VGA | Switches
bPlace: 3.3V | GND | ecog119 v2.0 | Project Name | R0 Xe7 | Gadget Factory, LLC | eCogs | Copyright 2016 | R1 Xe6 | ecog119.GadgetFactory.net | Xe0 A | G0 Xe5 | Xe1 B | G1 Xe4 | Xe2 C | B0 Xe3 | Xe3 D | B1 Xe2 | Xe4 E | VSYNC Xe1 | Xe5 F | HSYNC Xe0 | ecog120.GadgetFactory.net | Xe6 G | Copyright 2016 | Xe7 DP | Gadget Factory, LLC | eCogs | GND | Project Name | ecog120 v2.0 | 3.3V | 3.3V | GND | L7 Xe7 | S0 | L6 Xe6 | S1 | eCogs | L5 Xe5 | Button/LED | ecog106 v3.0 | S2 | L4 Xe4 | S3 | L3/SW3 Xe3 | L2/SW2 Xe2 | S4 | L1/SW1 Xe1 | S5 | L0/SW0 Xe0 | eCogs | S6 | Project Name | ecog118 v2.0 | S7 | ecog106.GadgetFactory.net | GND | Copyright 2016 | ecog118.GadgetFactory.net | Gadget Factory, LLC | Copyright 2016 | 3.3V | Gadget Factory, LLC